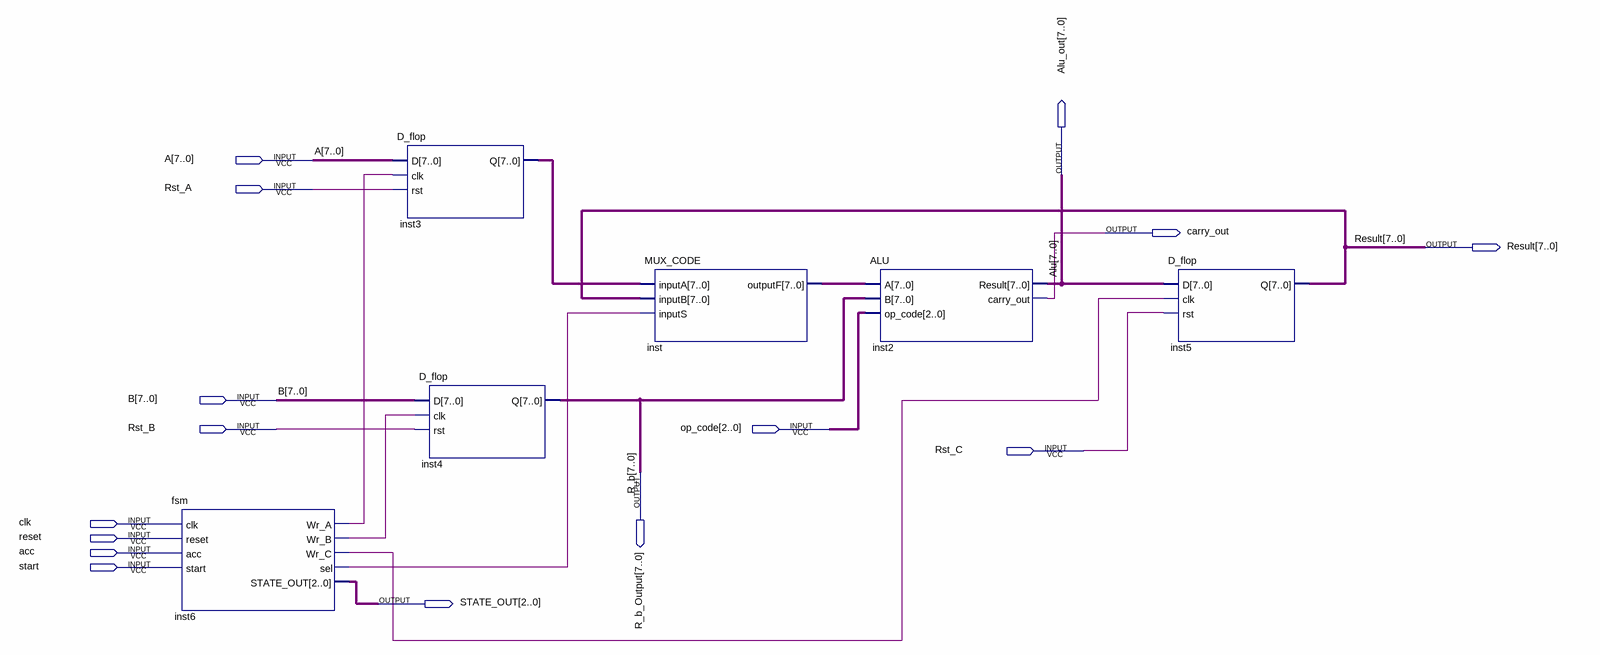
[diagram p0: schematic sheet]
// Quartus schematic ALU_Logic_Controller.bdf as structural Verilog: 6 symbols, 15 pins
module ALU_Logic_Controller (
  input  [7:0] A,
  input  Rst_A,
  input  [7:0] B,
  input  Rst_B,
  input  [2:0] op_code,
  input  Rst_C,
  input  clk,
  input  reset,
  input  acc,
  input  start,
  output [7:0] Alu_out,
  output carry_out,
  output [7:0] Result,
  output [7:0] R_b_Output,
  output [2:0] STATE_OUT
);

  wire inst6_sel, inst6_wr_a, inst6_wr_b, inst6_wr_c;
  wire [7:0] inst3_q, inst_outputf;

  fsm inst6 (
    .clk(clk), .reset(reset), .acc(acc), .start(start), .Wr_A(inst6_wr_a), .Wr_B(inst6_wr_b),
    .Wr_C(inst6_wr_c), .sel(inst6_sel), .STATE_OUT(STATE_OUT));
  D_flop inst3 (.D(A), .clk(inst6_wr_a), .rst(Rst_A), .Q(inst3_q));
  D_flop inst4 (.D(B), .clk(inst6_wr_b), .rst(Rst_B), .Q(R_b_Output));
  MUX_CODE inst (.inputA(inst3_q), .inputB(Result), .inputS(inst6_sel), .outputF(inst_outputf));
  ALU inst2 (.A(inst_outputf), .B(R_b_Output), .op_code(op_code), .Result(Alu_out), .carry_out(carry_out));
  D_flop inst5 (.D(Alu_out), .clk(inst6_wr_c), .rst(Rst_C), .Q(Result));

  // Other names for the same wires on the sheet: Alu[7:0] = Alu_out; R_b[7:0] = R_b_Output
endmodule
